# EAGLE schematic DDS_shield (EAGLE 7.5.0)
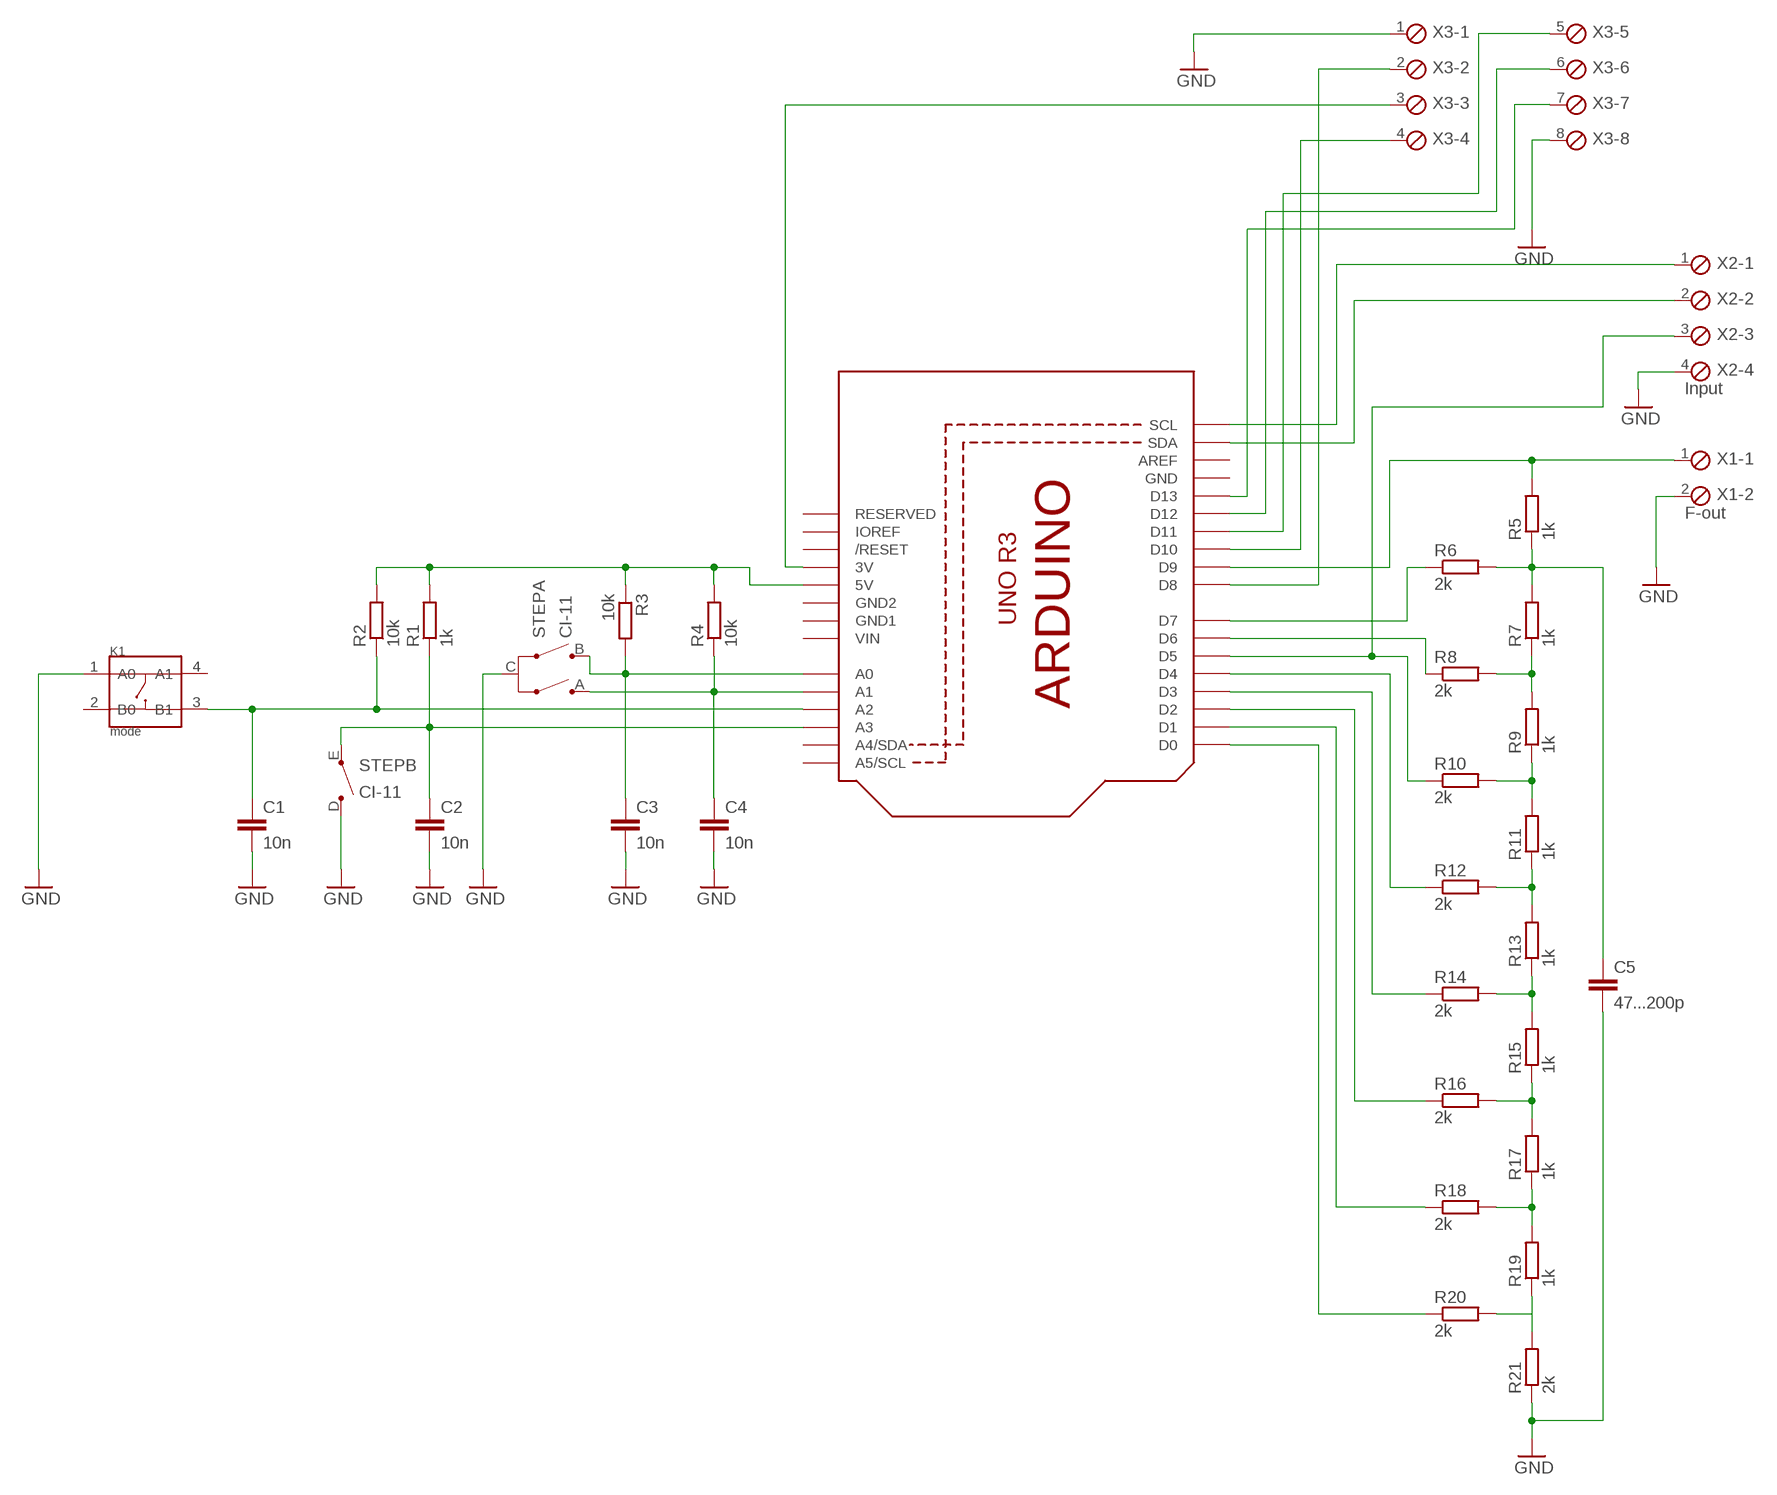
[diagram p0: schematic, sheet 1]

## Parts
C1  10n  C-EUC0805  [C0805]
C2  10n  C-EUC0805  [C0805]
C3  10n  C-EUC0805  [C0805]
C4  10n  C-EUC0805  [C0805]
C5  47...200p  C-EUC0805  [C0805]
K1  mode  DIP-BUTTON-4P  [SW4-6.0X6.0X5.0MM]
R1  1k  R-EU_M0805  [M0805]
R2  10k  R-EU_M0805  [M0805]
R3  10k  R-EU_M0805  [M0805]
R4  10k  R-EU_M0805  [M0805]
R5  1k  R-EU_M0805  [M0805]
R6  2k  R-EU_M0805  [M0805]
R7  1k  R-EU_M0805  [M0805]
R8  2k  R-EU_M0805  [M0805]
R9  1k  R-EU_M0805  [M0805]
R10  2k  R-EU_M0805  [M0805]
R11  1k  R-EU_M0805  [M0805]
R12  2k  R-EU_M0805  [M0805]
R13  1k  R-EU_M0805  [M0805]
R14  2k  R-EU_M0805  [M0805]
R15  1k  R-EU_M0805  [M0805]
R16  2k  R-EU_M0805  [M0805]
R17  1k  R-EU_M0805  [M0805]
R18  2k  R-EU_M0805  [M0805]
R19  1k  R-EU_M0805  [M0805]
R20  2k  R-EU_M0805  [M0805]
R21  2k  R-EU_M0805  [M0805]
STEP  CI-11  [CI-11]
U1  ARDUINOR3-BPLACE  [ARDUINOR3-BPLACE]
X1  F-out  MPT2  [2POL254]
X2  Input  MPT4  [4POL254]
X3  MPT8  [8POL254]

## Nets
GND: C1.2 C2.2 C3.2 C4.2 C5.2 K1.1(A0) R21.1 STEP.C(A:C) STEP.D(B:D) X1.2 X2.4 X3.1 X3.8
N$1: C1.1 K1.3(B1) R2.1 U1.A2
N$2: C2.1 R1.1 STEP.E(B:E) U1.A3
N$3: R1.2 R2.2 R3.1 R4.2 U1.5V
N$4: C4.1 R4.1 STEP.A(A:A) U1.A1
N$5: C3.1 R3.2 STEP.B(A:B) U1.A0
N$6: R5.2 U1.D9 X1.1
N$7: C5.1 R5.1 R6.2 R7.2
N$8: R6.1 U1.D7
N$9: R8.1 U1.D6
N$10: R10.1 U1.D5 X2.3
N$11: R12.1 U1.D4
N$12: R20.1 U1.D0
N$13: R18.1 U1.D1
N$14: R7.1 R8.2 R9.2
N$15: R14.1 U1.D3
N$16: R16.1 U1.D2
N$17: R9.1 R10.2 R11.2
N$18: R11.1 R12.2 R13.2
N$19: R13.1 R14.2 R15.2
N$20: R15.1 R16.2 R17.2
N$21: R17.1 R18.2 R19.2
N$22: R19.1 R20.2 R21.2
N$23: U1.D8 X3.2
N$24: U1.SDA X2.2
N$25: U1.SCL X2.1
N$26: U1.3V X3.3
N$27: U1.D10 X3.4
N$28: U1.D11 X3.5
N$29: U1.D12 X3.6
N$30: U1.D13 X3.7
Unconnected: K1.2(B0) K1.4(A1) U1.A4(A4/SDA) U1.A5(A5/SCL) U1.AREF U1.IOREF U1.RESERVED U1.RESET(/RESET)

## Power pins joined to a net without a drawn wire
GND: U1.GND
GND1: U1.GND1
GND2: U1.GND2
VIN: U1.VIN

## Library data of the parts
C1-C5 = rcl:C-EU: CAPACITOR, European symbol
K1 = Seeed-OPL-Button:DIP-BUTTON-4P: 311020024; MPN: TS-1109; VALUE: TS-1109
R1 = rcl:R-EU_: RESISTOR, European symbol; R1: 1k
R2-R21 = rcl:R-EU_: RESISTOR, European symbol
STEP = piher:CI-11: 11mm Incemental Encoder Source: www.piher.net .. 04-CI-11v04.pdf
U1 = adafruit:ARDUINOR3: This is a new object for the new Arduino R3 - with extra pins that you may want to use (such as IOref, and duplicated A4/A5
X1 = con-phoenix-254:MPT2: PHOENIX CONNECTOR
X2 = con-phoenix-254:MPT4: PHOENIX CONNECTOR
X3 = con-phoenix-254:MPT8: PHOENIX CONNECTOR